# EAGLE design hamilton-thermostat-interface (EAGLE 8.1.0)

## Sheet 1 of 2
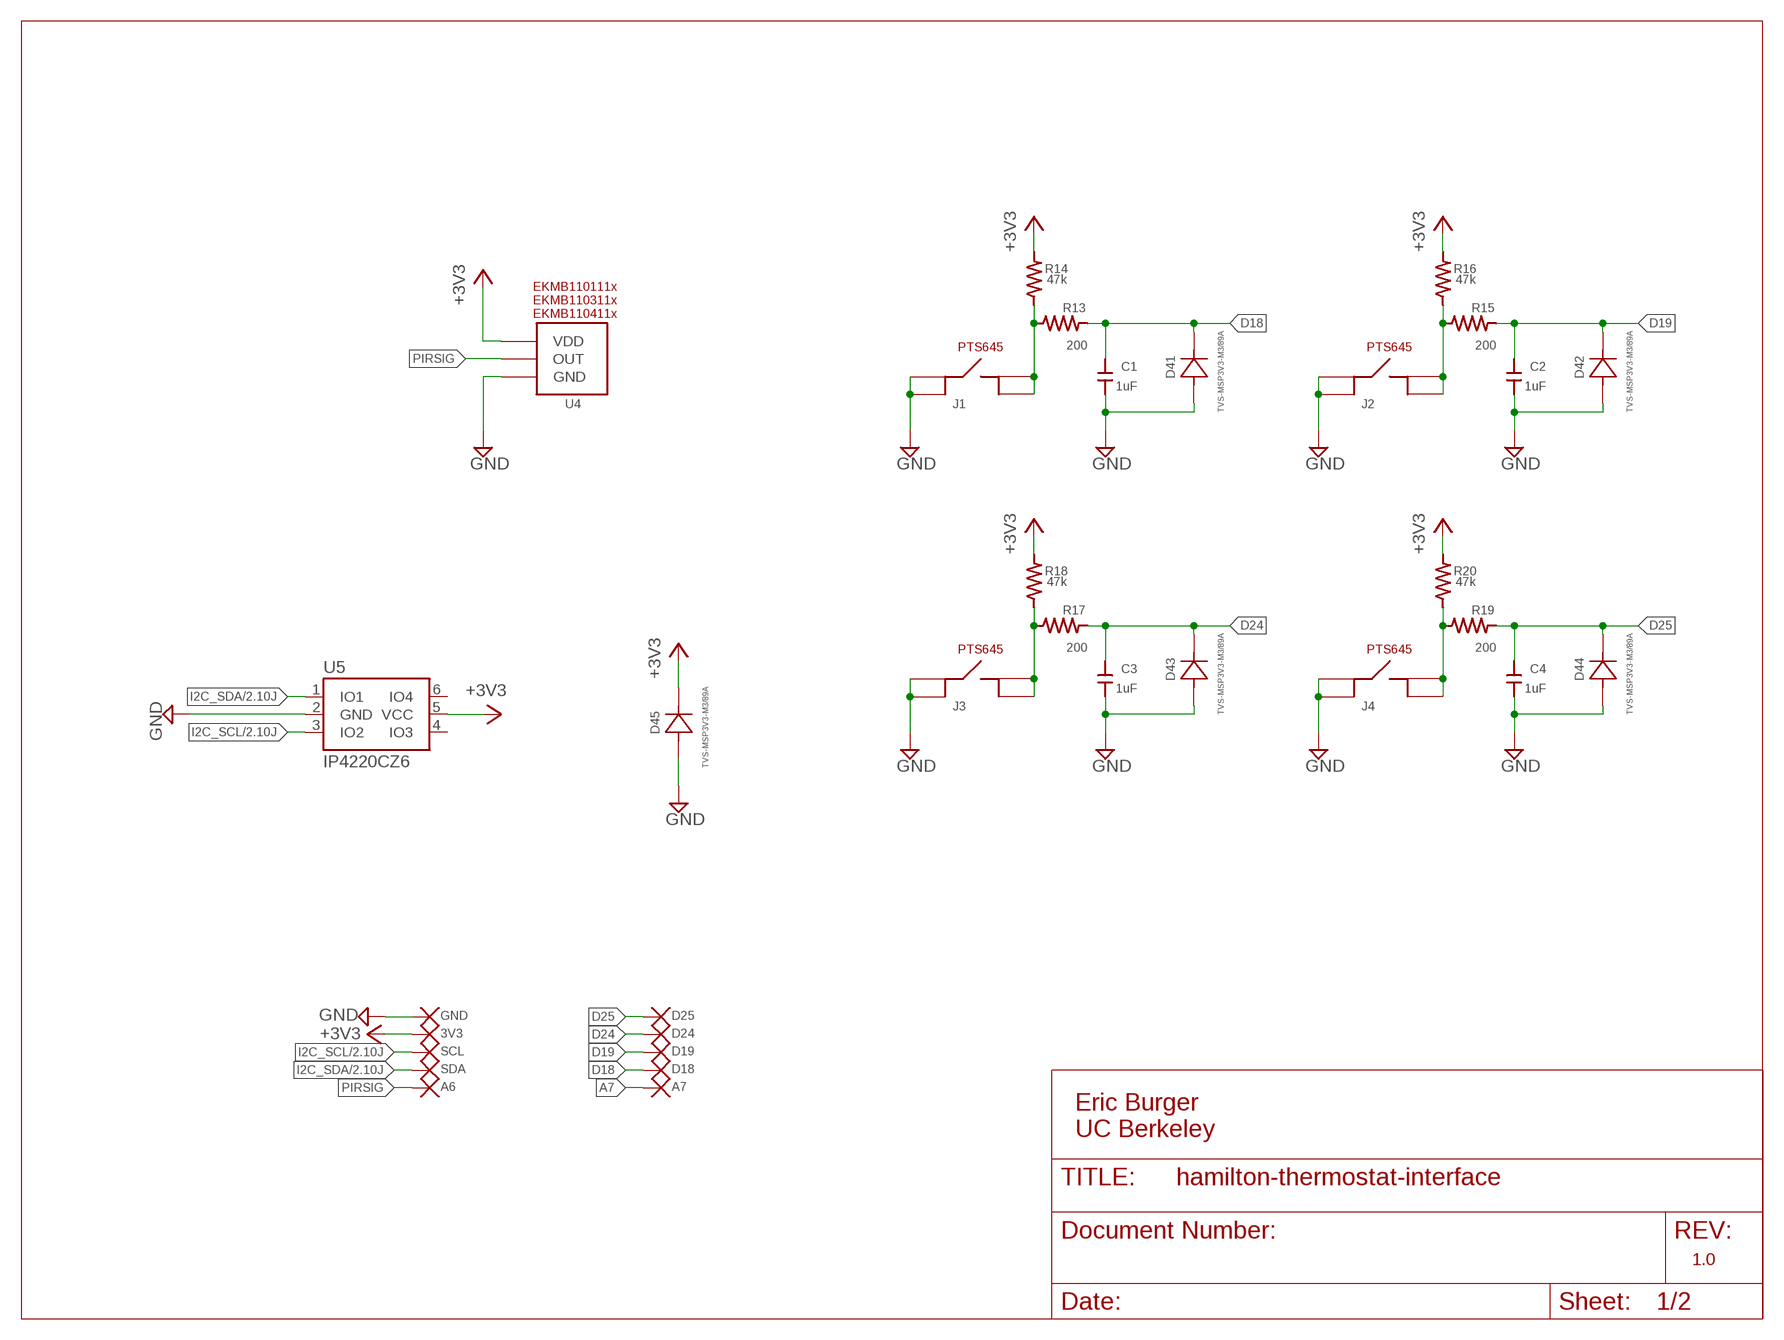
[diagram p0: schematic, sheet 1]

### Parts
C1  1uF  0603_CAPACITORSMALL  [S0402]
C2  1uF  0603_CAPACITORSMALL  [S0402]
C3  1uF  0603_CAPACITORSMALL  [S0402]
C4  1uF  0603_CAPACITORSMALL  [S0402]
D41  TVS-MSP3V3-M3/89A  MSP3V3-M3/89A  [DIODE_MSP3V3]
D42  TVS-MSP3V3-M3/89A  MSP3V3-M3/89A  [DIODE_MSP3V3]
D43  TVS-MSP3V3-M3/89A  MSP3V3-M3/89A  [DIODE_MSP3V3]
D44  TVS-MSP3V3-M3/89A  MSP3V3-M3/89A  [DIODE_MSP3V3]
D45  TVS-MSP3V3-M3/89A  MSP3V3-M3/89A  [DIODE_MSP3V3]
J1  PTS645  [PTS645]
J2  PTS645  [PTS645]
J3  PTS645  [PTS645]
J4  PTS645  [PTS645]
R13  200  0603_RESISTORSMALL  [S0402]
R14  47k  0603_RESISTORSMALL  [S0402]
R15  200  0603_RESISTORSMALL  [S0402]
R16  47k  0603_RESISTORSMALL  [S0402]
R17  200  0603_RESISTORSMALL  [S0402]
R18  47k  0603_RESISTORSMALL  [S0402]
R19  200  0603_RESISTORSMALL  [S0402]
R20  47k  0603_RESISTORSMALL  [S0402]
TP9  SDA  TP  [TPP]
TP10  SCL  TP  [TPP]
TP11  3V3  TP  [TPP]
TP12  GND  TP  [TPP]
TP14  D25  TP  [TPP]
TP15  D24  TP  [TPP]
TP16  A6  TP  [TPP]
TP17  D18  TP  [TPP]
TP18  D19  TP  [TPP]
TP19  A7  TP  [TPP]
U4  PANASONIC_PIR  [PIR]
U5  IP4220CZ6  IP4220CZ6SOT-23  [SOT23-6]

### Nets
+3V3: D45.1 R14.P$1 R16.P$1 R18.P$1 R20.P$1 TP11.P$1 U4.VDD U5.5(VCC) ; also sheet 2
A7: TP19.P$1
D18: C1.P$2 D41.1 R13.P$1 TP17.P$1
D19: C2.P$2 D42.1 R15.P$1 TP18.P$1
D24: C3.P$2 D43.1 R17.P$1 TP15.P$1
D25: C4.P$2 D44.1 R19.P$1 TP14.P$1
GND: C1.P$1 C2.P$1 C3.P$1 C4.P$1 D41.2 D42.2 D43.2 D44.2 D45.2 J1.3 J1.4 J2.3 J2.4 J3.3 J3.4 J4.3 J4.4 TP12.P$1 U4.GND U5.2(GND) ; also sheet 2
I2C_SCL: TP10.P$1 U5.3(IO2) ; also sheet 2
I2C_SDA: TP9.P$1 U5.1(IO1) ; also sheet 2
N$13: J1.1 J1.2 R13.P$2 R14.P$2
N$14: J2.1 J2.2 R15.P$2 R16.P$2
N$15: J3.1 J3.2 R17.P$2 R18.P$2
N$16: J4.1 J4.2 R19.P$2 R20.P$2
PIRSIG: TP16.P$1 U4.OUT
Unconnected: U5.4(IO3) U5.6(IO4)

### Notes on the sheet
- Eric Burger
  UC Berkeley
- 1.0

## Sheet 2 of 2
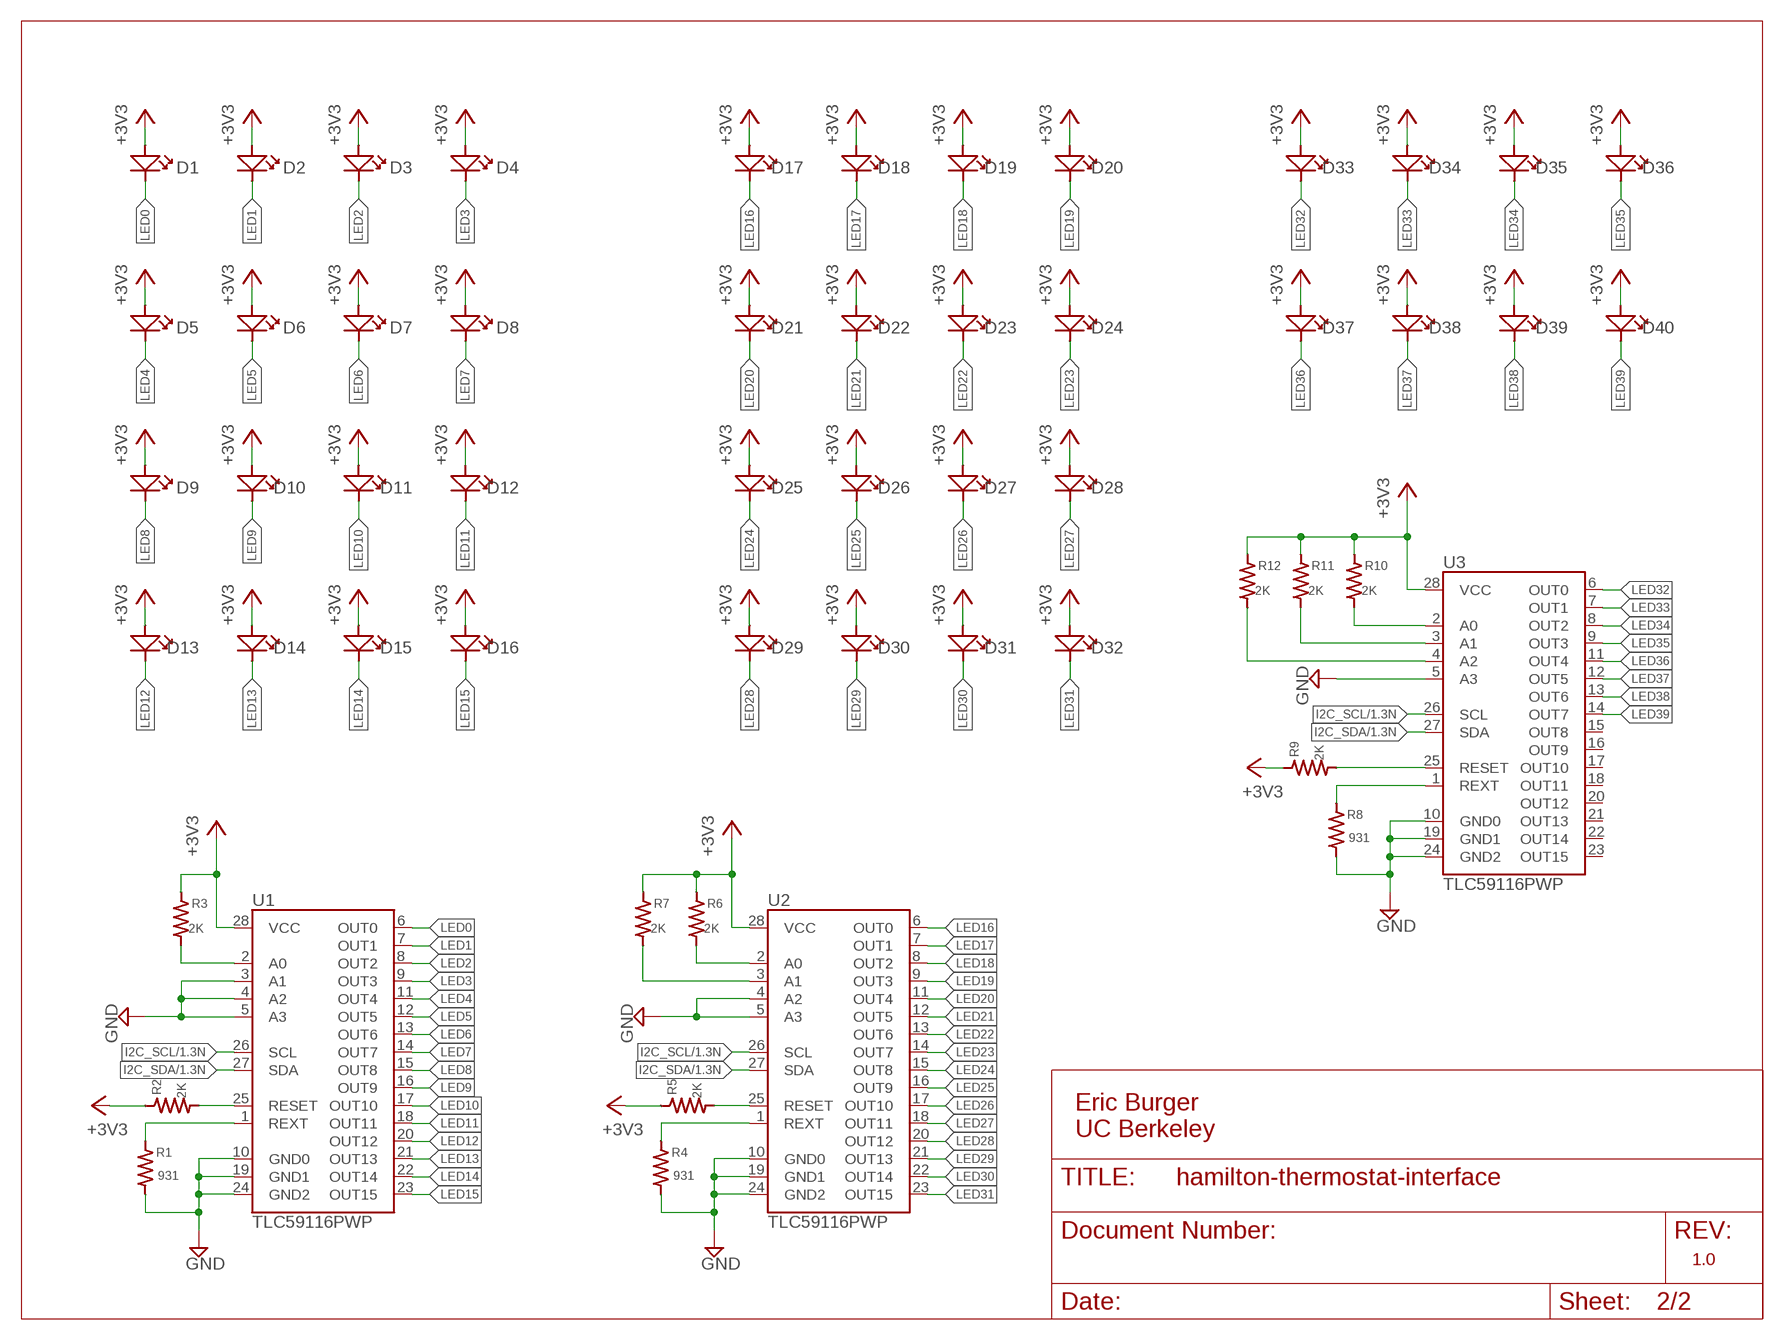
[diagram p1: schematic, sheet 2]

### Parts
D1  DNP  STATLEDLINE  [LINE_0603]
D2  DNP  STATLEDLINE  [LINE_0603]
D3  DNP  STATLEDLINE  [LINE_0603]
D4  DNP  STATLEDLINE  [LINE_0603]
D5  DNP  STATLEDLINE  [LINE_0603]
D6  DNP  STATLEDLINE  [LINE_0603]
D7  DNP  STATLEDLINE  [LINE_0603]
D8  DNP  STATLEDLINE  [LINE_0603]
D9  DNP  STATLEDLINE  [LINE_0603]
D10  DNP  STATLEDLINE  [LINE_0603]
D11  DNP  STATLEDLINE  [LINE_0603]
D12  DNP  STATLEDLINE  [LINE_0603]
D13  DNP  STATLEDLINE  [LINE_0603]
D14  DNP  STATLEDLINE  [LINE_0603]
D15  DNP  STATLEDLINE  [LINE_0603]
D16  DNP  STATLEDLINE  [LINE_0603]
D17  DNP  STATLEDLINE  [LINE_0603]
D18  DNP  STATLEDLINE  [LINE_0603]
D19  DNP  STATLEDLINE  [LINE_0603]
D20  DNP  STATLEDLINE  [LINE_0603]
D21  DNP  STATLEDLINE  [LINE_0603]
D22  DNP  STATLEDLINE  [LINE_0603]
D23  DNP  STATLEDLINE  [LINE_0603]
D24  DNP  STATLEDLINE  [LINE_0603]
D25  DNP  STATLEDLINE  [LINE_0603]
D26  DNP  STATLEDLINE  [LINE_0603]
D27  DNP  STATLEDLINE  [LINE_0603]
D28  DNP  STATLEDLINE  [LINE_0603]
D29  DNP  STATLEDLINE  [LINE_0603]
D30  DNP  STATLEDLINE  [LINE_0603]
D31  DNP  STATLEDLINE  [LINE_0603]
D32  DNP  STATLEDLINE  [LINE_0603]
D33  DNP  STATLEDLINE  [LINE_0603]
D34  DNP  STATLEDLINE  [LINE_0603]
D35  DNP  STATLEDLINE  [LINE_0603]
D36  DNP  STATLEDLINE  [LINE_0603]
D37  DNP  STATLEDLINE  [LINE_0603]
D38  DNP  STATLEDLINE  [LINE_0603]
D39  DNP  STATLEDLINE  [LINE_0603]
D40  DNP  STATLEDLINE  [LINE_0603]
R1  931  0603_RESISTORSMALL  [S0402]
R2  2K  0603_RESISTORSMALL  [S0402]
R3  2K  0603_RESISTORSMALL  [S0402]
R4  931  0603_RESISTORSMALL  [S0402]
R5  2K  0603_RESISTORSMALL  [S0402]
R6  2K  0603_RESISTORSMALL  [S0402]
R7  2K  0603_RESISTORSMALL  [S0402]
R8  931  0603_RESISTORSMALL  [S0402]
R9  2K  0603_RESISTORSMALL  [S0402]
R10  2K  0603_RESISTORSMALL  [S0402]
R11  2K  0603_RESISTORSMALL  [S0402]
R12  2K  0603_RESISTORSMALL  [S0402]
U1  TLC59116PWP  [TSSOP28-GROUNDPAD]
U2  TLC59116PWP  [TSSOP28-GROUNDPAD]
U3  TLC59116PWP  [TSSOP28-GROUNDPAD]

### Nets
+3V3: D1.P(+) D2.P(+) D3.P(+) D4.P(+) D5.P(+) D6.P(+) D7.P(+) D8.P(+) D9.P(+) D10.P(+) D11.P(+) D12.P(+) D13.P(+) D14.P(+) D15.P(+) D16.P(+) D17.P(+) D18.P(+) D19.P(+) D20.P(+) D21.P(+) D22.P(+) D23.P(+) D24.P(+) D25.P(+) D26.P(+) D27.P(+) D28.P(+) D29.P(+) D30.P(+) D31.P(+) D32.P(+) D33.P(+) D34.P(+) D35.P(+) D36.P(+) D37.P(+) D38.P(+) D39.P(+) D40.P(+) R2.P$2 R3.P$2 R5.P$2 R6.P$2 R7.P$2 R9.P$2 R10.P$2 R11.P$2 R12.P$2 U1.28(VCC) U2.28(VCC) U3.28(VCC) ; also sheet 1
GND: R1.P$1 R4.P$1 R8.P$1 U1.3(A1) U1.4(A2) U1.5(A3) U1.10(GND0) U1.19(GND1) U1.24(GND2) U2.4(A2) U2.5(A3) U2.10(GND0) U2.19(GND1) U2.24(GND2) U3.5(A3) U3.10(GND0) U3.19(GND1) U3.24(GND2) ; also sheet 1
I2C_SCL: U1.26(SCL) U2.26(SCL) U3.26(SCL) ; also sheet 1
I2C_SDA: U1.27(SDA) U2.27(SDA) U3.27(SDA) ; also sheet 1
LED0: D1.N(-) U1.6(OUT0)
LED1: D2.N(-) U1.7(OUT1)
LED2: D3.N(-) U1.8(OUT2)
LED3: D4.N(-) U1.9(OUT3)
LED4: D5.N(-) U1.11(OUT4)
LED5: D6.N(-) U1.12(OUT5)
LED6: D7.N(-) U1.13(OUT6)
LED7: D8.N(-) U1.14(OUT7)
LED8: D9.N(-) U1.15(OUT8)
LED9: D10.N(-) U1.16(OUT9)
LED10: D11.N(-) U1.17(OUT10)
LED11: D12.N(-) U1.18(OUT11)
LED12: D13.N(-) U1.20(OUT12)
LED13: D14.N(-) U1.21(OUT13)
LED14: D15.N(-) U1.22(OUT14)
LED15: D16.N(-) U1.23(OUT15)
LED16: D17.N(-) U2.6(OUT0)
LED17: D18.N(-) U2.7(OUT1)
LED18: D19.N(-) U2.8(OUT2)
LED19: D20.N(-) U2.9(OUT3)
LED20: D21.N(-) U2.11(OUT4)
LED21: D22.N(-) U2.12(OUT5)
LED22: D23.N(-) U2.13(OUT6)
LED23: D24.N(-) U2.14(OUT7)
LED24: D25.N(-) U2.15(OUT8)
LED25: D26.N(-) U2.16(OUT9)
LED26: D27.N(-) U2.17(OUT10)
LED27: D28.N(-) U2.18(OUT11)
LED28: D29.N(-) U2.20(OUT12)
LED29: D30.N(-) U2.21(OUT13)
LED30: D31.N(-) U2.22(OUT14)
LED31: D32.N(-) U2.23(OUT15)
LED32: D33.N(-) U3.6(OUT0)
LED33: D34.N(-) U3.7(OUT1)
LED34: D35.N(-) U3.8(OUT2)
LED35: D36.N(-) U3.9(OUT3)
LED36: D37.N(-) U3.11(OUT4)
LED37: D38.N(-) U3.12(OUT5)
LED38: D39.N(-) U3.13(OUT6)
LED39: D40.N(-) U3.14(OUT7)
N$1: R3.P$1 U1.2(A0)
N$2: R6.P$1 U2.2(A0)
N$3: R4.P$2 U2.1(REXT)
N$4: R5.P$1 U2.25(RESET)
N$5: R7.P$1 U2.3(A1)
N$6: R1.P$2 U1.1(REXT)
N$7: R10.P$1 U3.2(A0)
N$8: R2.P$1 U1.25(RESET)
N$9: R8.P$2 U3.1(REXT)
N$10: R9.P$1 U3.25(RESET)
N$11: R11.P$1 U3.3(A1)
N$12: R12.P$1 U3.4(A2)
Unconnected: U3.15(OUT8) U3.16(OUT9) U3.17(OUT10) U3.18(OUT11) U3.20(OUT12) U3.21(OUT13) U3.22(OUT14) U3.23(OUT15)

### Notes on the sheet
- Eric Burger
  UC Berkeley
- 1.0

## Library data of the parts
C1-C4 = storm:0603_CAPACITOR
D1-D40 = storm:STATLED
D41-D45 = MSP3V3-M3-89A:MSP3V3-M3/89A: Vishay Semiconductor Diodes Division MSP3V3-M3/89A, TVS DIODE 3.3VWM MICROSMP; MANUFACTURER_PART_NUMBER: MSP3V3M389A; VENDOR: Vishay
J1-J4 = storm:PTS645
R1-R20 = storm:0603_RESISTOR
TP9-TP12 TP14-TP19 = storm:TP
U1-U3 = MyLibrary:TLC59116: 16-channel I2C-Bus Constant-Current LED Sink Driver The TLC59116 is an I2C bus controlled 16-channel LED driver that is optimized for red/green/blue/amber (RGBA) color mixing and backlight application. Each LED output has its own 8-bit resolution (256 steps) fixed-frequency individual PWM controller that operates at 97 kHz, with a duty cycle that is adjustable from 0% to 99.6%. Packages: 28-pin HTSSOP 32-pin 5x5mm QFN 28-pin DIP
U4 = storm:PANASONIC_PIR
U5 = MyLibrary:IP4220CZ6: IC ESD PROTECT (TVS DIODES) 6TSOP/SOT23-6

## Board
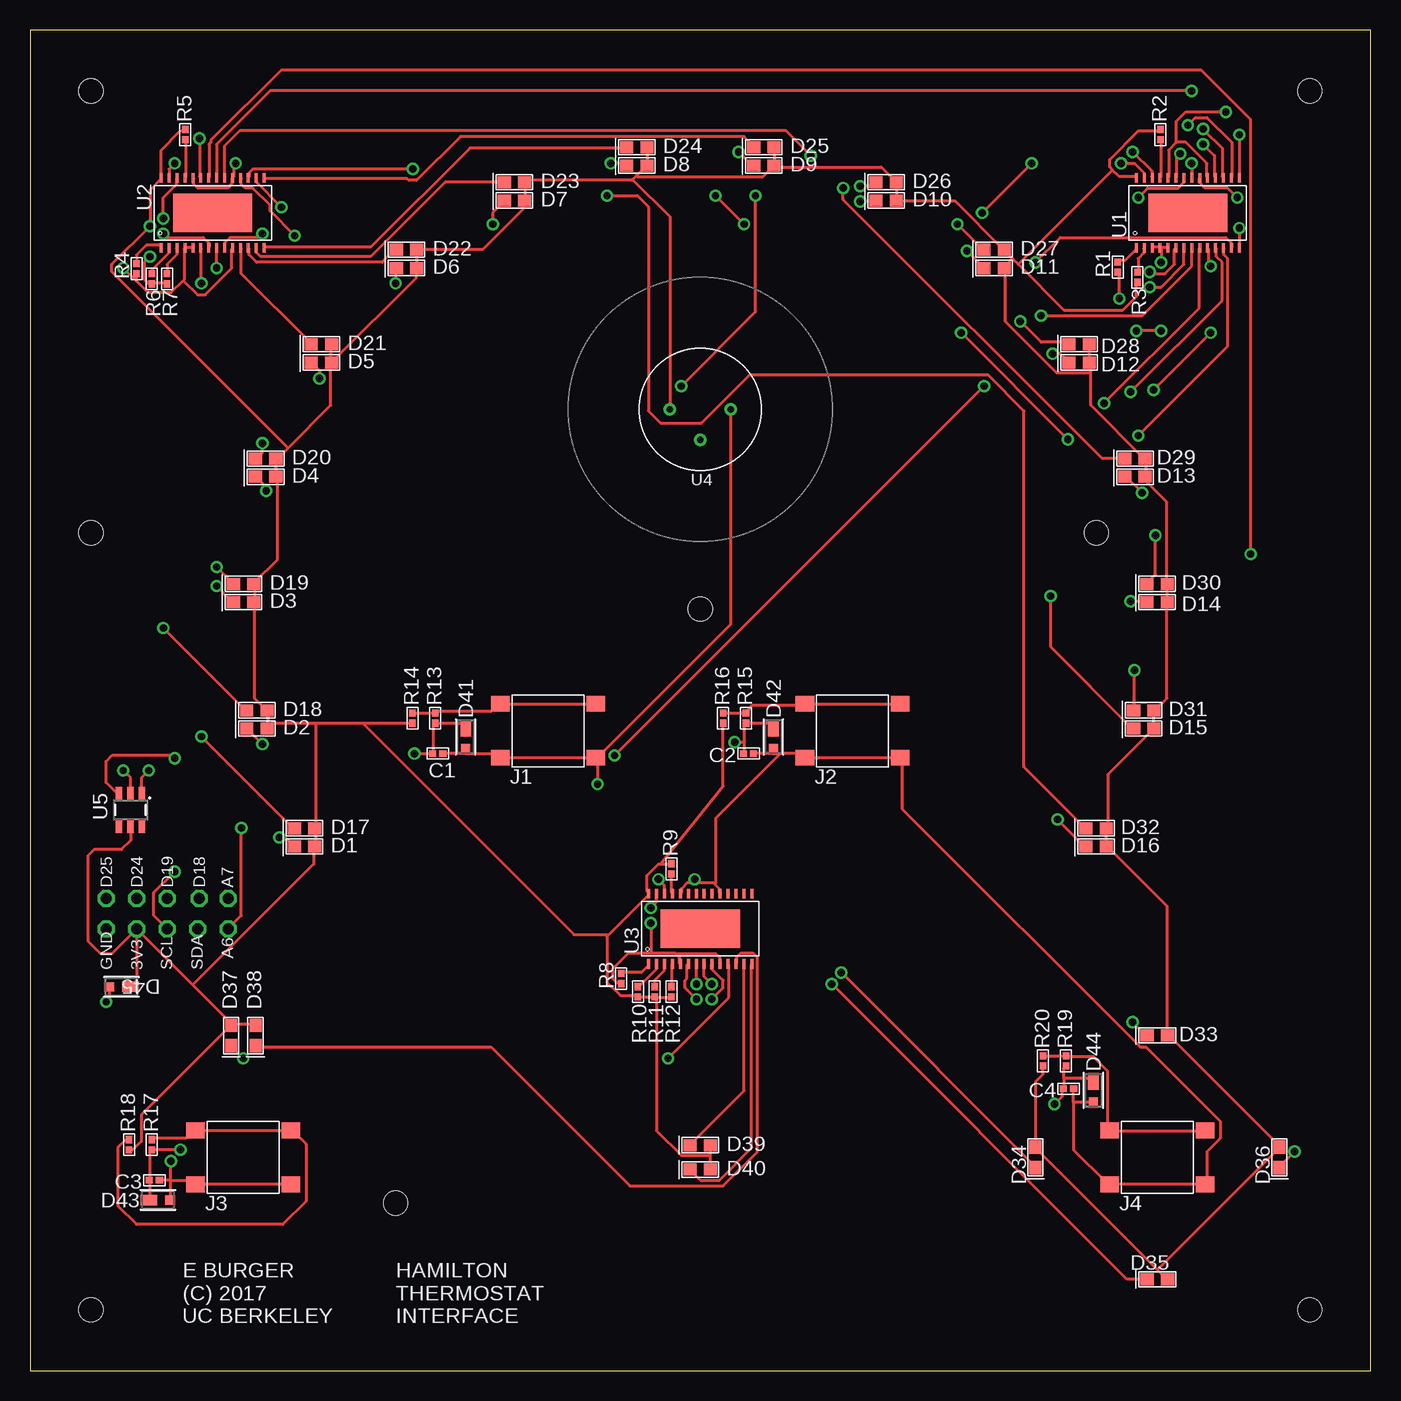
[diagram p2: board, top side]
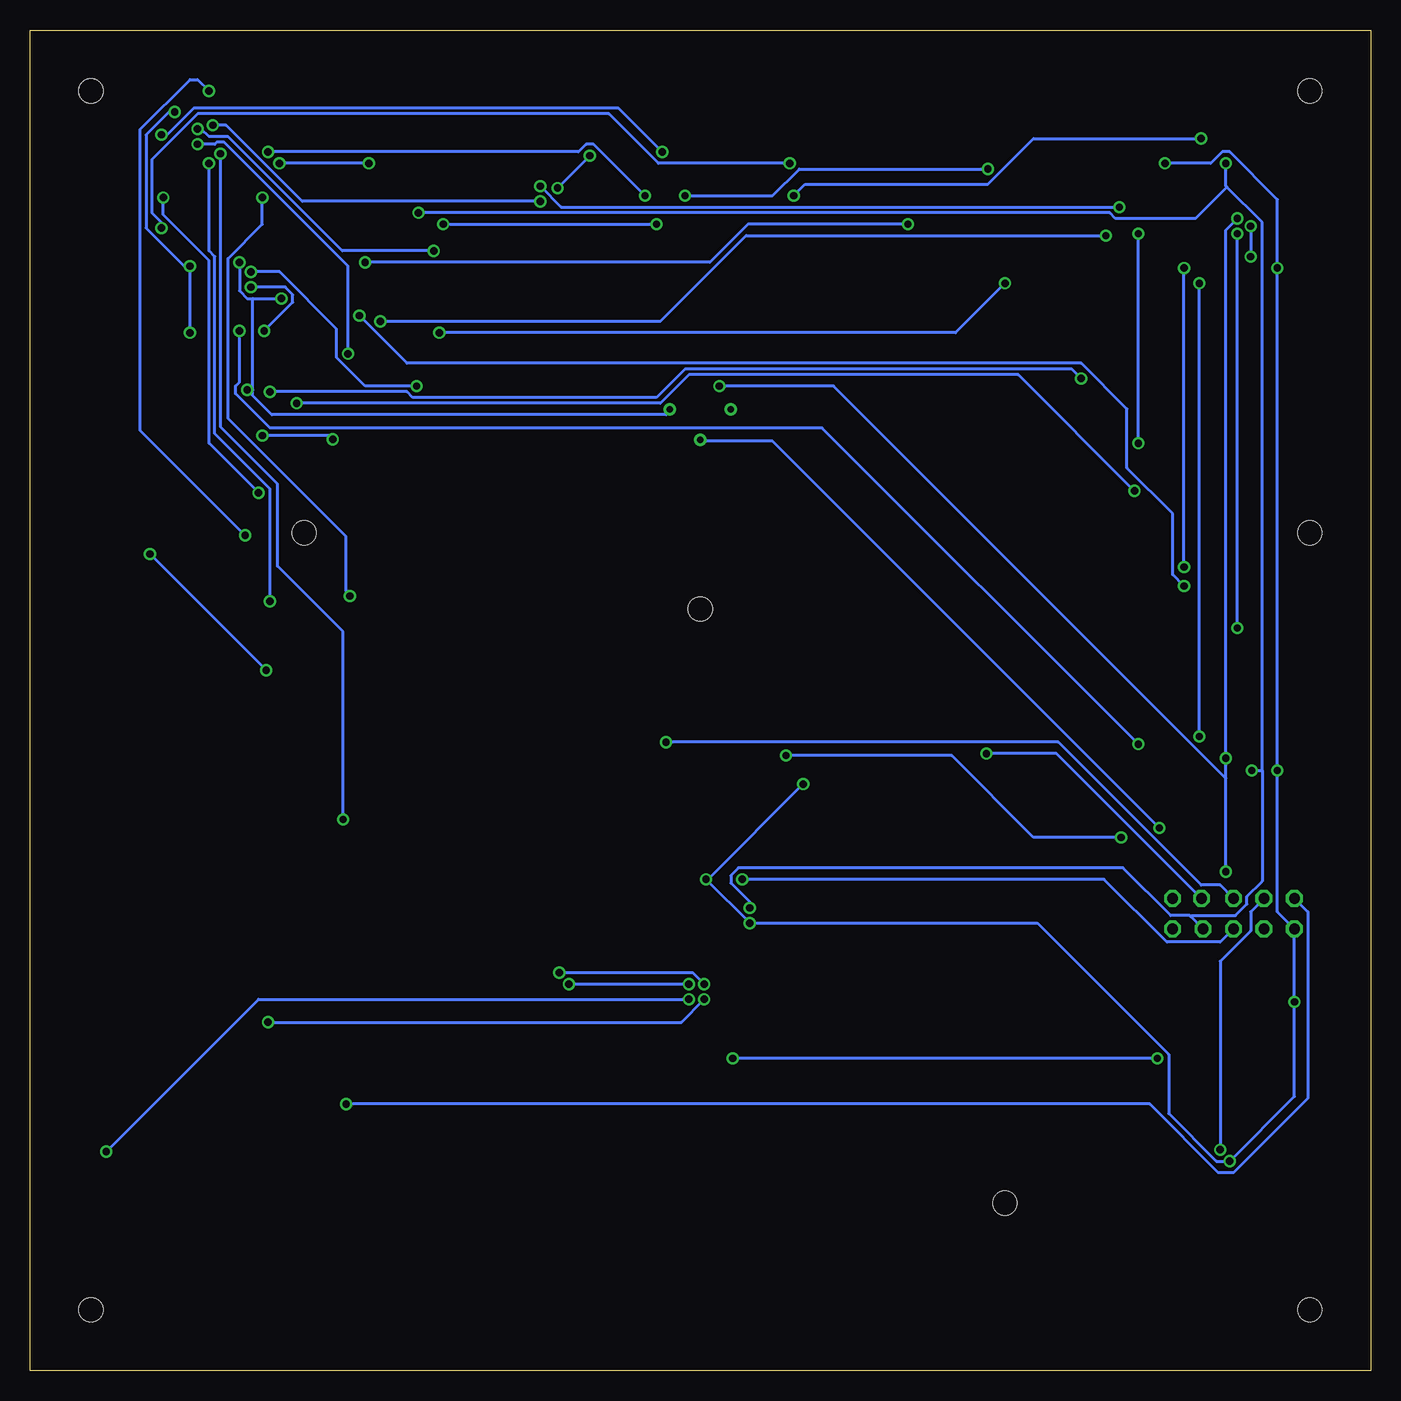
[diagram p3: board, bottom side, seen from below]

Size 111.76 x 111.76 mm. Coordinates in mm from the lower left corner, seen from the top.
Outline: 0,0 111.76,0 111.76,111.76 0,111.76 0,0
Copper layers (1*16): Top 0.035mm / dielectric 1.5mm / Bottom 0.035mm
Design rules "default": minimum track width 10mil, minimum drill 24mil, track to track 8mil, track to pad 8mil, pad to pad 8mil, via to via 8mil, smd to smd 8mil, copper to edge 40mil, drill to drill 8mil, minimum pad ring 10mil, minimum via ring 8mil, stop-mask expansion 4mil, vias tented up to drill 0mil, thermal gap 10mil
Holes 2 mm at 5.08,69.85 88.9,69.85 30.48,13.97 55.88,63.5 5.08,106.68 106.68,106.68 5.08,5.08 106.68,5.08

### Footprints (pad centres in the part's own frame; a part is rotated, then mirrored left to right if it is on the bottom)
S0402 = smd 0.6 x 0.55: P$1 0,0; P$2 0.85,0
LINE_0603 = smd 1.1 x 1: N -0.85,0; P 0.85,0
DIODE_MSP3V3 = smd 1.397 x 0.889: 1 -0.749,0 | smd 0.864 x 0.762: 2 1.016,0
PTS645 = smd 1.55 x 1.3: 1 -3.975,2.25; 2 3.975,2.25; 3 -3.975,-2.25; 4 3.975,-2.25
TPP = drill 0.9 octagon: P$1 0,0
TSSOP28-GROUNDPAD = smd 0.8 x 0.25: 1 -2.921,4.298; 2 -2.921,3.637; 3 -2.921,2.977; 4 -2.921,2.317; 5 -2.921,1.656; 6 -2.921,0.996; 7 -2.921,0.335; 8 -2.927,-0.325; 9 -2.921,-0.985; 10 -2.921,-1.646; 11 -2.921,-2.306; 12 -2.921,-2.967; 13 -2.921,-3.627; 14 -2.921,-4.287; 15 2.921,-4.287; 16 2.921,-3.627; 17 2.921,-2.967; 18 2.921,-2.306; 19 2.921,-1.646; 20 2.921,-0.985; 21 2.927,-0.325; 22 2.921,0.335; 23 2.921,0.996; 24 2.921,1.656; 25 2.921,2.317; 26 2.921,2.977; 27 2.921,3.637; 28 2.921,4.298 | smd 3.2 x 6.6: 29 0,0.005
PIR = drill 0.55: GND 0,0; OUT 2.54,-2.54; VDD 0,-5.08
SOT23-6 = smd 0.55 x 1.2: 1 0.95,1.3; 2 0,1.3; 3 -0.95,1.3; 4 -0.95,-1.3; 5 0,-1.3; 6 0.95,-1.3

### Placement (x,y rotation side)
C1  34.42,51.44 180 top
C2  60.32,51.44 180 top
C3  10.79,15.88 180 top
C4  86.99,23.49 180 top
D1  22.88,43.69 0 top
D2  18.91,53.52 0 top
D3  17.8,64.07 0 top
D4  19.64,74.51 0 top
D5  24.29,84.04 0 top
D6  31.39,91.92 0 top
D7  40.38,97.54 0 top
D8  50.58,100.47 0 top
D9  61.18,100.47 0 top
D10  71.38,97.54 0 top
D11  80.37,91.92 0 top
D12  87.47,84.04 0 top
D13  92.12,74.51 0 top
D14  93.96,64.07 0 top
D15  92.85,53.52 0 top
D16  88.88,43.69 0 top
D17  22.88,45.21 0 top
D18  18.91,55.04 0 top
D19  17.8,65.59 0 top
D20  19.64,76.04 0 top
D21  24.29,85.57 0 top
D22  31.39,93.45 0 top
D23  40.38,99.07 0 top
D24  50.58,101.99 0 top
D25  61.18,101.99 0 top
D26  71.38,99.07 0 top
D27  80.37,93.45 0 top
D28  87.47,85.57 0 top
D29  92.12,76.04 0 top
D30  93.96,65.59 0 top
D31  92.85,55.04 0 top
D32  88.88,45.21 0 top
D33  93.98,27.94 0 top
D34  83.82,17.78 90 top
D35  93.98,7.62 0 top
D36  104.14,17.78 90 top
D37  16.76,27.94 90 top
D38  18.8,27.94 90 top
D39  55.88,18.8 0 top
D40  55.88,16.76 0 top
D41  36.32,52.83 270 top
D42  61.98,52.83 270 top
D43  10.67,14.22 0 top
D44  88.65,23.37 270 top
D45  7.62,32 180 top
J1  43.18,53.34 0 top
J2  68.58,53.34 0 top
J3  17.78,17.78 0 top
J4  93.98,17.78 0 top
R1  90.68,91.57 90 top
R2  94.23,102.62 90 top
R3  92.33,91.57 270 top
R4  8.89,91.44 90 top
R5  12.95,102.62 90 top
R6  10.16,91.44 270 top
R7  11.43,91.44 270 top
R8  49.28,32.26 90 top
R9  53.47,41.4 90 top
R10  50.67,32 270 top
R11  52.07,32 270 top
R12  53.47,32 270 top
R13  33.78,53.98 90 top
R14  31.88,53.98 90 top
R15  59.69,53.98 90 top
R16  57.79,53.98 90 top
R17  10.16,18.41 90 top
R18  8.25,18.41 90 top
R19  86.36,25.4 90 top
R20  84.45,25.4 90 top
TP9  13.97,36.83 0 top
TP10  11.43,36.83 0 top
TP11  8.89,36.83 0 top
TP12  6.35,36.83 0 top
TP14  6.35,39.37 90 top
TP15  8.89,39.37 90 top
TP16  16.51,36.83 0 top
TP17  14.1,39.37 0 top
TP18  11.43,39.37 0 top
TP19  16.51,39.37 0 top
U1  96.52,96.52 90 top
U2  15.24,96.52 90 top
U3  55.88,36.83 90 top
U4  58.42,80.14 270 top
U5  8.38,46.74 0 top

### Tracks (layer width: path | path; a pad name or v marks a point on that pad's centre or on a via)
+3V3  (via drill 0.61)
  Top 0.254: R20.P$1 84.45,24.7 83.82,24.07 D34.P 83.82,18.57 93.98,8.41 | 93.98,8.41 94.77,7.62 D35.P | 93.98,8.41 104.14,18.57 D36.P 104.14,18.73 94.93,27.94 D33.P 94.77,27.94 94.77,38.73 89.85,43.66 D16.P 89.69,43.82 89.69,45.09 D32.P 89.85,45.24 89.85,49.69 93.66,53.5 D15.P 93.66,53.66 93.66,54.93 D31.P 93.82,55.09 94.77,56.04 94.77,63.98 D14.P 94.77,64.13 94.77,65.56 D30.P 94.77,65.72 94.77,72.39 93.03,74.14 93.03,74.45 D13.P 93.03,74.61 93.03,75.88 D29.P 92.87,76.04 88.42,80.49 88.42,83.19 | D28.P 88.27,85.57 88.27,84.14 D12.P 88.42,83.98 88.42,83.19 | 56.67,17.94 56.67,18.73 D39.P | 56.67,17.94 56.67,16.83 D40.P | 52.07,31.11 50.8,31.11 R10.P$2 50.64,31.27 49.21,31.27 48.1,32.39 48.1,36.2 48.18,36.27 | 52.07,31.11 52.23,31.11 | 52.23,31.11 53.34,31.11 R12.P$2 | 52.07,31.11 R11.P$2 52.23,31.11 | 52.55,42.23 52.39,42.23 51.44,41.28 51.44,40.01 51.59,39.85 U3.28 51.59,39.69 48.18,36.27 | 52.55,42.23 53.34,42.23 R9.P$2 | R16.P$1 57.79,48.74 52.55,42.23 | 56.67,17.94 54.29,17.94 52.23,20 52.23,31.11 | D9.P 62.07,100.49 62.07,101.92 D25.P | D9.P 62.07,100.33 70.96,100.33 72.07,99.22 D26.P 72.23,97.63 D10.P 72.23,97.47 77.15,97.47 81.12,93.5 D27.P 81.28,93.34 81.91,92.71 | 90.25,100.09 90.8,99.54 92.23,99.54 U1.28 | 90.25,100.09 90.01,100.33 90.01,100.96 92.39,103.35 94.14,103.35 R2.P$2 | 81.91,92.71 82.39,92.23 | 82.39,92.23 86.2,88.42 91.12,88.42 92.23,89.53 92.23,90.65 R3.P$2 | 81.91,92.71 81.28,92.07 D11.P 81.28,91.92 81.28,87.47 85.57,83.19 88.42,83.19 | 82.39,92.23 90.25,100.09 | D24.P 51.44,101.92 51.44,100.49 D8.P 51.28,100.33 50.56,99.62 | 50.56,99.62 50.24,99.3
  Top 0.254: 50.24,99.3 50.16,99.22 41.28,99.22 D23.P 41.28,99.06 41.28,97.63 D7.P 41.12,97.47 41.12,96.84 37.78,93.5 32.39,93.5 D22.P 32.23,93.34 32.23,92.07 D6.P 32.23,91.92 32.23,91.12 25.24,84.14 D5.P | U4.VDD 53.34,96.2 50.24,99.3 | R18.P$1 8.57,18.41 9.27,19.11 9.27,21.34 16.67,28.73 D37.P 16.83,28.89 | 16.83,28.89 18.73,28.89 D38.P | 16.83,28.89 13.57,32.15 | 13.57,32.15 TP11.P$1 | 10.16,90.65 11.43,90.65 R7.P$2 | R5.P$2 12.86,103.35 12.54,103.35 10.95,101.76 10.95,99.54 U2.28 10.95,99.38 10,98.42 v10,95.41 6.83,92.23 6.83,91.6 21.51,76.91 | 10.16,90.65 9.84,90.65 9.52,90.96 9.52,92.39 v10,92.87 | 10.16,90.65 R6.P$2 | D5.P 25.08,84.14 25.08,85.57 D21.P | 23.81,53.98 20.16,53.98 19.84,53.66 D2.P 19.84,53.82 19.84,54.93 D18.P 19.68,55.09 18.73,56.04 18.73,63.98 D3.P 18.73,64.13 18.73,65.56 D19.P 18.73,65.72 20.64,67.63 20.64,74.45 D4.P 20.48,74.61 20.48,75.88 D20.P 20.64,76.04 21.51,76.91 | 23.81,53.98 27.72,53.98 | 27.72,53.98 R14.P$1 | 23.81,53.98 23.81,45.24 D17.P 23.81,45.09 23.81,43.82 D1.P 23.65,43.66 23.65,42.23 13.57,32.15 | 21.51,76.91 25.08,80.49 25.08,83.98 D5.P | D9.P 61.91,100.33 61.12,99.54 50.64,99.54 50.56,99.62 | 27.72,53.98 45.34,36.35 48.1,36.35 48.18,36.27 | U5.5 8.38,44.2 7.62,43.43 5.33,43.43 4.83,42.93 4.83,35.81 5.84,34.8 6.86,34.8 TP11.P$1 | TP11.P$1 8.89,32.53 D45.1
  Bottom 0.254: v10,95.41 v10,92.87
D18  (via drill 0.61)
  Top 0.254: v32.04,51.44 C1.P$2 33.62,51.44 33.62,53.82 R13.P$1 36.32,53.98 D41.1
  Bottom 0.254: v32.04,51.44 26.19,51.44 14.13,39.37 TP17.P$1
D19  (via drill 0.61)
  Top 0.254: 59.53,52.39 59.53,53.82 R15.P$1 61.98,53.98 D42.1 | 59.53,52.39 59.53,51.44 C2.P$2 | v58.74,52.39 59.53,52.39
  Bottom 0.254: v58.74,52.39 26.04,52.39 14.13,40.48 12.54,40.48 TP18.P$1
D24  (via drill 0.61)
  Top 0.254: 10,15.88 10,18.26 R17.P$1 v12.54,18.41 | 10,15.88 C3.P$2 | D43.1 10,14.22 10,15.88
  Bottom 0.254: v12.54,18.41 12.54,34.13 10,36.67 10,38.26 TP15.P$1
D25  (via drill 0.61)
  Top 0.254: 86.2,24.38 86.2,25.24 R19.P$1 | 86.2,24.38 86.2,23.49 C4.P$2 86.04,23.49 86.04,22.86 v85.41,22.22 | D44.1 88.41,24.12 88.14,24.38 86.2,24.38
  Bottom 0.254: v85.41,22.22 18.41,22.22 12.7,16.51 11.43,16.51 5.24,22.7 5.24,38.26 TP14.P$1
GND  (via drill 0.6, 0.61)
  Top 0.254: U2.24 13.65,99.38 13.65,98.9 13.97,98.58 16.51,98.58 16.83,98.9 16.83,99.38 U2.19 16.99,99.54 16.99,100.49 v17.14,100.65 | 8.89,90.8 R4.P$1 | 8.89,90.8 9.84,89.85 11.75,89.85 12.78,90.88 | 12.78,90.88 12.86,90.96 12.86,93.5 U2.4 13.02,93.66 13.49,93.66 U2.5 | 12.78,90.88 13.97,89.69 14.61,89.69 16.83,91.92 16.83,93.5 U2.10 | 8.89,90.8 v7.78,91.92 | 11.75,15.88 13.33,15.88 13.65,15.56 J3.3 13.81,15.56 21.75,15.56 J3.4 | 11.75,15.88 C3.P$1 | 11.75,15.88 v11.75,17.46 | 86.99,22.35 C4.P$1 | 86.99,22.35 86.99,18.41 89.85,15.56 J4.3 90.01,15.56 97.95,15.56 J4.4 98.11,15.56 98.11,18.26 99.22,19.37 99.22,20.8 93.03,26.99 92.55,26.99 72.71,46.83 72.71,50.96 J2.4 72.55,51.12 64.61,51.12 J2.3 64.45,51.12 64.13,51.44 62.55,51.44 | 51.75,34.77 53.82,34.77 53.9,34.69 | 51.75,34.77 49.85,34.77 48.58,33.5 48.58,32.7 48.9,32.39 49.21,32.39 R8.P$1 | 53.9,34.69 54.13,34.45 54.13,33.97 U3.5 | U3.10 57.47,33.97 57.47,34.45 57.15,34.77 53.98,34.77 53.9,34.69 | 55.4,40.64 56.99,40.64 57.07,40.56 | 55.4,40.64 54.77,40.64 54.29,40.16 54.29,39.85 U3.24 | 57.07,40.56 57.47,40.16 57.47,39.85 U3.19 | 61.98,51.44 62.55,51.44 | 61.98,51.44 C2.P$1 | 62.55,51.44 57.15,46.04 57.15,40.64 57.07,40.56 | v51.75,37.31 51.75,34.77 | 55.4,40.64 v55.4,40.96 | 95.57,102.39 94.93,101.76 94.93,99.54 U1.24 | 95.57,102.39 96.36,102.39 98.11,100.65 98.11,99.54 U1.19 | v98.42,92.07 98.27,92.23 98.27,93.5 U1.10 | v99.69,104.93 96.36,104.93 95.57,104.14 95.57,102.39 | v90.8,89.38 90.8,91.44 R1.P$1 | v94.3,92.39 94.3,93.5 U1.4 | U1.3 93.66,93.66 94.14,93.66 U1.4 | U1.5 94.77,93.66 94.3,93.66 U1.4 | 36.32,51.44 38.73,51.44 39.05,51.12 J1.3 39.21,51.12 47.15,51.12 J1.4
  Top 0.254: 36.32,51.44 C1.P$1 | U4.GND 58.42,62.23 47.31,51.12 J1.4 | v93.66,81.76 v98.42,86.52 | v47.31,48.9 47.31,50.96 J1.4 | U5.2 8.38,49.44 v7.78,50.04 | D41.2 36.32,51.44 | D42.2 61.98,51.44 | D43.2 11.75,14.22 11.75,15.88 | D44.2 86.99,22.35 | D45.2 6.6,30.99 v6.35,30.73
  Bottom 0.254: v17.14,100.65 13.33,100.65 12.38,101.6 11.75,101.6 7.78,97.63 v7.78,91.92 v7.78,50.04 7.78,38.26 TP12.P$1 v6.35,30.73 6.35,22.86 v11.75,17.46 12.86,17.46 16.83,21.43 16.83,26.35 27.78,37.31 v51.75,37.31 v55.4,40.96 55.25,40.96 v47.31,48.9 | v99.69,104.93 100.17,104.93 102.08,103.03 102.08,95.25 98.9,92.07 v98.42,92.07 v98.42,86.52 | 93.19,89.38 93.66,89.38 94.3,90.01 v94.3,92.39 | 93.19,89.38 v90.8,89.38 | 93.19,81.76 93.19,81.28 91.6,79.69 58.74,79.69 58.42,80.01 U4.GND | 93.19,81.76 93.19,89.38 | 93.19,81.76 v93.66,81.76
I2C_SCL  (via drill 0.6, 0.61)
  Top 0.254: v52.39,40.96 52.86,40.48 52.86,39.85 U3.26 | v11.11,96.04 11.11,97.79 12.22,98.9 12.22,99.38 U2.26 | v12.06,41.59 10.32,39.85 10.32,37.94 TP10.P$1 | v91.92,101.6 93.5,100.01 93.5,99.54 U1.26 | v60.48,97.95 60.48,88.27 v54.29,82.07 | U5.3 7.34,48.04 6.35,49.02 6.35,50.8 6.86,51.31 11.81,51.31 v12.06,51.05
  Bottom 0.254: v52.39,40.96 22.22,40.96 16.99,35.72 12.54,35.72 TP10.P$1 | v11.11,96.04 12.06,95.09 v12.06,51.05 12.06,49.37 | v12.06,41.59 12.06,49.37 | v91.92,101.6 66.04,101.6 65.41,102.23 64.77,102.23 v60.48,97.95 | v54.29,82.07 44.77,82.07 12.06,49.37
I2C_SDA  (via drill 0.6, 0.61)
  Top 0.254: v51.75,38.58 52.23,39.05 52.23,39.69 U3.27 | v12.06,100.65 11.59,100.17 11.59,99.54 U2.27 | v90.96,100.65 92.07,100.65 92.87,99.85 92.87,99.54 U1.27 | v79.38,96.52 v83.5,100.65 | U5.1 9.33,49.46 v9.91,50.04
  Bottom 0.254: v51.75,38.58 51.75,39.05 53.34,40.64 53.34,41.28 52.71,41.91 20.64,41.91 16.67,37.94 15.08,37.94 15,37.86 | TP9.P$1 15,37.86 | v12.06,100.65 12.06,98.74 11.99,98.66 | 11.99,98.66 9.05,95.73 9.05,50.04 | 9.05,50.04 9.05,40.8 10.32,39.53 10.32,38.89 11.27,37.94 14.92,37.94 15,37.86 | v83.5,100.65 v90.96,100.65 | v79.38,96.52 21.75,96.52 21.27,96.04 14.61,96.04 11.99,98.66 | v9.91,50.04 9.05,50.04
LED0  (via drill 0.61)
  Top 0.254: v93.34,91.6 93.5,91.44 94.61,91.44 95.41,92.23 95.41,93.5 U1.6 | v48.74,51.28 v79.53,82.07 | v20.8,44.45 21.27,44.45 21.91,43.82 D1.N
  Bottom 0.254: v93.34,91.6 90.96,91.6 86.2,86.84 86.2,84.45 83.82,82.07 v79.53,82.07 | v48.74,51.28 34.93,51.28 28.1,44.45 v20.8,44.45
LED1  (via drill 0.61)
  Top 0.254: v93.34,90.33 94.3,90.33 96.2,92.23 96.2,93.5 U1.7 | v94.3,86.68 v92.23,86.68 | v19.37,52.23 18.1,53.5 D2.N
  Bottom 0.254: v93.34,90.33 90.49,90.33 89.85,89.69 89.85,89.06 v92.23,86.68 | v94.3,86.68 94.3,82.39 94.61,82.07 94.61,81.44 91.76,78.58 45.72,78.58 v19.37,52.23
LED2  (via drill 0.61)
  Top 0.254: v84.3,87.95 92.71,87.95 96.84,92.07 96.84,93.5 U1.8 | v15.56,65.41 16.83,64.13 D3.N
  Bottom 0.254: v84.3,87.95 80.33,83.98 24.13,83.98 20.32,80.17 20.32,75.25 16.51,71.44 16.51,66.36 v15.56,65.41
LED3  (via drill 0.61)
  Top 0.254: v89.53,80.64 97.47,88.58 97.47,93.5 U1.9 | v19.68,73.34 19.68,73.66 18.89,74.45 D4.N
  Bottom 0.254: v89.53,80.64 59.21,80.64 56.83,83.03 29.37,83.03 v19.68,73.34
LED4  (via drill 0.61)
  Top 0.254: v91.76,81.6 99.38,89.22 99.38,92.39 98.9,92.87 98.9,93.5 U1.11 | v24.13,82.71 24.13,83.34 23.49,83.98 D5.N
  Bottom 0.254: v91.76,81.6 80.33,81.6 79.85,81.12 59.53,81.12 57.15,83.5 24.92,83.5 v24.13,82.71
LED5  (via drill 0.61)
  Top 0.254: v92.39,77.95 99.85,85.41 99.85,92.71 99.54,93.03 99.54,93.5 U1.12 | v77.63,86.52 v86.52,77.63 | v30.48,90.65 30.48,91.92 D6.N
  Bottom 0.254: v92.39,77.95 86.84,77.95 v86.52,77.63 | v77.63,86.52 34.61,86.52 v30.48,90.65
LED6  (via drill 0.61)
  Top 0.254: v83.82,92.39 85.88,94.46 99.69,94.46 100.17,93.98 100.17,93.66 U1.13 | v38.58,95.57 38.58,96.52 39.53,97.47 D7.N
  Bottom 0.254: v83.82,92.39 55.09,92.39 51.91,95.57 v38.58,95.57
LED7  (via drill 0.61)
  Top 0.254: v100.81,95.25 100.81,93.66 U1.14 | v48.42,100.65 49.53,100.65 49.69,100.49 D8.N
  Bottom 0.254: v100.81,95.25 100.81,95.73 101.6,96.52 101.6,100.96 97.79,104.77 63.5,104.77 59.37,100.65 v48.42,100.65
LED8  (via drill 0.61)
  Top 0.254: v100.81,103.03 100.81,99.54 U1.15 | v59.05,101.6 60.32,100.33 D9.N
  Bottom 0.254: v100.81,103.03 100.33,103.03 98.11,105.25 62.71,105.25 v59.05,101.6
LED9  (via drill 0.61)
  Top 0.254: v96.52,103.82 97.16,104.46 98.11,104.46 100.17,102.39 100.17,99.54 U1.16 | v69.21,97.47 70.48,97.47 D10.N
  Bottom 0.254: v96.52,103.82 95.41,103.82 89.06,97.47 v69.21,97.47
LED10  (via drill 0.61)
  Top 0.254: v97.79,103.5 99.38,101.92 99.38,99.54 U1.17 | v78.1,93.34 79.38,92.07 D11.N
  Bottom 0.254: v97.79,103.5 97.47,103.5 96.84,102.87 95.25,102.87 85.72,93.34 v78.1,93.34
LED11  (via drill 0.61)
  Top 0.254: v97.79,102.23 98.74,101.28 98.74,99.54 U1.18 | v85.25,84.77 85.88,84.77 86.52,84.14 D12.N
  Bottom 0.254: v97.79,102.23 96.36,102.23 96.2,102.39 95.57,102.39 85.25,92.07 v85.25,84.77
LED12  (via drill 0.61)
  Top 0.254: v100.65,97.79 99.85,98.58 97.95,98.58 97.47,99.06 97.47,99.38 U1.20 | v92.71,73.18 91.28,74.61 D13.N
  Bottom 0.254: v100.65,97.79 100.65,96.36 96.84,92.55 96.84,77.31 v92.71,73.18
LED13  (via drill 0.61)
  Top 0.254: v96.84,100.65 96.84,99.54 U1.21 | v91.76,64.13 93.03,64.13 D14.N
  Bottom 0.254: v96.84,100.65 96.84,93.34 96.36,92.87 96.36,78.1 91.76,73.5 v91.76,64.13
LED14  (via drill 0.61)
  Top 0.254: v92.39,97.79 93.19,98.58 95.73,98.58 96.2,99.06 96.2,99.38 U1.22 | v85.09,64.58 85.09,60.32 91.92,53.5 D15.N
  Bottom 0.254: v92.39,97.79 92.39,95.57 95.25,92.71 95.25,79.38 85.41,69.53 85.41,65.02 v85.09,64.58
LED15  (via drill 0.61)
  Top 0.254: v95.88,101.44 95.57,101.12 95.57,99.54 U1.23 | v85.66,45.94 87.95,43.66 D16.N
  Bottom 0.254: v95.88,101.44 95.88,78.68 91.12,73.91 91.12,67.06 85.66,61.6 v85.66,45.94
LED16  (via drill 0.61)
  Top 0.254: v14.29,90.65 14.29,93.5 U2.6 | v14.29,52.86 21.91,45.24 D17.N
  Bottom 0.254: v14.29,52.86 v14.29,90.65
LED17  (via drill 0.61)
  Top 0.254: v11.11,94.77 11.43,94.46 14.45,94.46 14.92,93.98 14.92,93.66 U2.7 | v11.11,61.91 17.94,55.09 D18.N
  Bottom 0.254: v11.11,61.91 v11.11,94.77
LED18  (via drill 0.61)
  Top 0.254: v15.56,91.92 15.56,93.5 U2.8 | v15.56,66.99 16.83,65.72 D19.N
  Bottom 0.254: v15.56,66.99 v15.56,91.92
LED19  (via drill 0.61)
  Top 0.254: v19.37,94.77 19.05,94.46 16.67,94.46 16.19,93.98 16.19,93.66 U2.9 | v19.37,77.31 19.37,76.52 18.89,76.04 D20.N
  Bottom 0.254: v19.37,77.31 v19.37,94.77
LED20
  Top 0.254: U2.11 17.62,93.5 17.62,91.44 23.34,85.72 D21.N
LED21
  Top 0.254: U2.12 18.26,93.5 18.26,93.03 18.89,92.39 29.37,92.39 30.48,93.5 D22.N
LED22
  Top 0.254: U2.13 18.89,93.5 18.89,93.19 19.21,92.87 28.42,92.87 34.61,99.06 D23.N
LED23
  Top 0.254: U2.14 19.53,93.66 28.42,93.66 36.67,101.92 49.69,101.92 D24.N
LED24
  Top 0.254: U2.15 19.53,99.38 31.43,99.38 31.59,99.22 32.23,99.22 35.88,102.87 59.53,102.87 60.32,102.08 D25.N
LED25  (via drill 0.61)
  Top 0.254: v20.95,97 18.89,99.06 18.89,99.38 U2.16 | v69.21,98.74 70.17,98.74 70.48,99.06 D26.N
  Bottom 0.254: v20.95,97 67.47,97 v69.21,98.74
LED26  (via drill 0.61)
  Top 0.254: v31.91,100.17 18.57,100.17 18.26,99.85 18.26,99.54 U2.17 | v59.53,95.57 v57.15,97.95 | v77.31,95.57 79.38,93.5 D27.N
  Bottom 0.254: v31.91,100.17 47.62,100.17 49.85,97.95 v57.15,97.95 | v77.31,95.57 v59.53,95.57
LED27  (via drill 0.61)
  Top 0.254: v22.07,94.61 20,96.68 20,97.16 18.57,98.58 17.94,98.58 17.62,98.9 17.62,99.38 U2.18 | v82.55,87.47 84.3,85.72 86.52,85.72 D28.N
  Bottom 0.254: v22.07,94.61 52.07,94.61 59.21,87.47 v82.55,87.47
LED28  (via drill 0.61)
  Top 0.254: v65.09,101.28 63.02,103.35 17.46,103.35 16.19,102.08 16.19,99.54 U2.20 | v67.79,98.58 67.79,97.63 89.38,76.04 91.12,76.04 D29.N
  Bottom 0.254: v67.79,98.58 v65.09,101.28
LED29  (via drill 0.61)
  Top 0.254: v96.84,106.68 20,106.68 15.56,102.23 15.56,99.54 U2.21 | v93.82,69.63 93.82,66.36 93.19,65.72 D30.N
  Bottom 0.254: v96.84,106.68 97.79,107.63 98.42,107.63 102.55,103.5 102.55,78.36 v93.82,69.63
LED30  (via drill 0.61)
  Top 0.254: v101.76,68.07 101.76,104.3 97.63,108.43 20.95,108.43 15.08,102.55 15.08,102.39 14.92,102.23 14.92,99.54 U2.22 | v92.07,58.39 92.07,55.09 D31.N
  Bottom 0.254: v92.07,58.39 v101.76,68.07
LED31  (via drill 0.61)
  Top 0.254: v14.13,102.71 14.13,99.54 U2.23 | v48.1,97.95 50.64,97.95 51.56,97.03 51.56,80.01 52.58,78.99 55.98,78.99 60.01,83.03 79.85,83.03 82.87,80.01 82.87,50.32 87.95,45.24 D32.N
  Bottom 0.254: v14.13,102.71 28.1,102.71 31.91,98.9 47.15,98.9 v48.1,97.95
LED32  (via drill 0.61)
  Top 0.254: v55.56,30.96 54.61,31.91 54.61,32.54 54.77,32.7 54.77,33.81 U3.6 | v91.92,29.05 93.03,27.94 D33.N
  Bottom 0.254: v55.56,30.96 57.47,29.05 v91.92,29.05
LED33  (via drill 0.61)
  Top 0.254: v55.56,32.23 55.56,33.81 U3.7 | v67.63,33.18 83.82,16.99 D34.N
  Bottom 0.254: v55.56,32.23 56.52,33.18 v67.63,33.18
LED34  (via drill 0.61)
  Top 0.254: v56.83,32.23 56.2,32.86 56.2,33.81 U3.8 | v66.83,32.23 91.44,7.62 D35.N
  Bottom 0.254: v66.83,32.23 v56.83,32.23
LED35  (via drill 0.61)
  Top 0.254: v56.83,30.96 57.79,31.91 57.79,32.54 56.83,33.5 56.83,33.81 U3.9 | v105.41,18.26 104.14,16.99 D36.N
  Bottom 0.254: v56.83,30.96 92.71,30.96 v105.41,18.26
LED36  (via drill 0.61)
  Top 0.254: v53.18,26.04 58.26,31.11 58.26,33.81 U3.11 | v17.78,26.04 16.83,26.99 D37.N
  Bottom 0.254: v17.78,26.04 v53.18,26.04
LED37
  Top 0.254: U3.12 58.9,33.97 58.9,34.45 59.21,34.77 60.32,34.77 60.64,34.45 60.64,18.26 57.79,15.4 50.01,15.4 38.42,26.99 18.89,26.99 D38.N
LED38
  Top 0.254: U3.13 59.53,33.81 59.53,23.34 55.09,18.89 D39.N
LED39
  Top 0.254: U3.14 60.17,33.81 60.17,18.57 57.47,15.88 55.88,15.88 55.09,16.67 D40.N
N$1
  Top 0.254: R3.P$1 92.39,91.6 92.39,92.71 92.87,93.19 92.87,93.5 U1.2
N$2
  Top 0.254: R6.P$1 10.16,91.76 11.59,93.19 11.59,93.5 U2.2
N$3
  Top 0.254: R4.P$2 8.89,93.03 9.68,93.82 10.79,93.82 10.95,93.66 U2.1
N$4
  Top 0.254: R5.P$1 13.02,102.55 13.02,99.54 U2.25
N$5
  Top 0.254: R7.P$1 11.43,92.23 12.22,93.03 12.22,93.5 U2.3
N$6
  Top 0.254: R1.P$2 90.8,92.55 91.28,92.55 92.23,93.5 U1.1
N$7
  Top 0.254: R10.P$1 50.8,32.07 52.23,33.5 52.23,33.81 U3.2
N$8
  Top 0.254: R2.P$1 94.3,102.55 94.3,99.54 U1.25
N$9
  Top 0.254: R8.P$2 49.37,33.18 50.96,33.18 51.59,33.81 U3.1
N$10
  Top 0.254: R9.P$1 53.5,41.28 53.5,39.85 U3.25
N$11
  Top 0.254: R11.P$1 52.07,32.54 52.86,33.34 52.86,33.81 U3.3
N$12
  Top 0.254: R12.P$1 53.5,32.07 53.5,33.81 U3.4
N$13
  Top 0.254: R14.P$2 31.88,54.77 33.78,54.77 R13.P$2 34.04,54.93 38.42,54.93 39.05,55.56 J1.1 39.21,55.56 47.15,55.56 J1.2
N$14
  Top 0.254: R16.P$2 57.79,54.77 59.69,54.77 R15.P$2 60.2,55.44 64.07,55.44 64.45,55.56 J2.1 64.61,55.56 72.55,55.56 J2.2
N$15
  Top 0.254: R17.P$2 10.16,19.37 13.02,19.37 13.65,20 J3.1 13.81,20 21.75,20 J3.2 21.91,20 23.02,18.89 23.02,14.13 21.08,12.19 8.89,12.19 7.37,13.72 7.37,18.64 7.94,19.21 8.25,19.21 R18.P$2
N$16
  Top 0.254: 86.36,26.19 84.45,26.19 R20.P$2 | 86.36,26.19 86.42,26.19 86.45,26.16 88.65,26.16 89.85,24.96 89.85,20.16 J4.1 90.01,20 97.95,20 J4.2 | 86.36,26.19 R19.P$2
PIRSIG  (via drill 0.61)
  Top 0.254: v17.62,45.24 17.62,37.94 TP16.P$1
  Bottom 0.254: v17.62,45.24 49.85,77.47 55.88,77.47 U4.OUT

### Text on the board
tPlace: E BURGER / (C) 2017 / UC BERKELEY | HAMILTON / THERMOSTAT / INTERFACE